# Altium schematic sheet XMOD.SchDoc
size A4; CompanyName: Technische Hochschule Nürnberg Georg Simon Ohm; Organization: UltraZohm; Address1: Kesslerplatz 12; Address2: 90489 Nürnberg; Address3: GERMANY; SheetNumber: 15; SheetTotal: 36; Website: www.ultrazohm.com
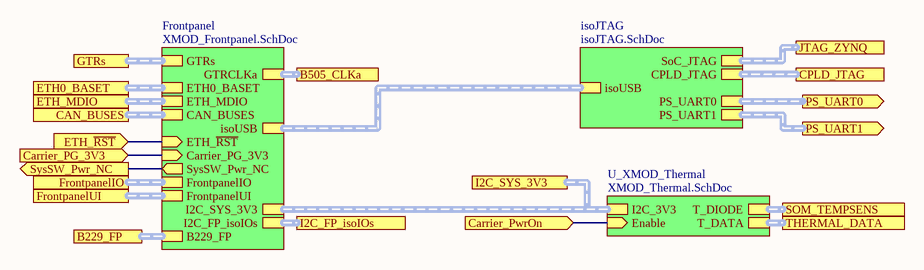
[diagram p0: XMOD.SchDoc]

## Sub-sheets
Frontpanel = XMOD_Frontpanel.SchDoc: GTRs (harness GTRs), ETH0_BASET (harness ETH_BASET), ETH_MDIO (harness ETH_MDIO), isoUSB (harness USB), I2C_SYS_3V3 (harness I2C), FrontpanelUI (harness FrontpanelUI), SysSW_Pwr_NC (out), GTRCLKa (harness MGTCLK), CAN_BUSES (harness CAN_BUSES), FrontpanelIO (harness FrontpanelIO), ETH_~{RST} (in), Carrier_PG_3V3 (in), I2C_FP_isoIOs (harness I2C), B229_FP (harness GTH)
isoJTAG = isoJTAG.SchDoc: SoC_JTAG (harness JTAG), CPLD_JTAG (harness JTAG), PS_UART0 (harness UART), PS_UART1 (harness UART), isoUSB (harness USB)
U_XMOD_Thermal = XMOD_Thermal.SchDoc: I2C_3V3 (harness I2C), T_DIODE (harness T_DIODE), T_DATA (harness T_DATA), Enable (in)

## Ports
B229_FP (harness GTH), B505_CLKa (harness MGTCLK), CAN_BUSES (harness CAN_BUSES), Carrier_PG_3V3 (in), Carrier_PwrOn (in), CPLD_JTAG (harness JTAG), ETH0_BASET (harness ETH_BASET), ETH_MDIO (harness ETH_MDIO), ETH_~{RST} (in), FrontpanelIO (harness FrontpanelIO), FrontpanelUI (harness FrontpanelUI), GTRs (harness GTRs), I2C_FP_isoIOs (harness I2C), I2C_SYS_3V3 (harness I2C), JTAG_ZYNQ (harness JTAG), PS_UART0 (out, harness UART), PS_UART1 (out, harness UART), SOM_TEMPSENS (harness T_DIODE), SysSW_Pwr_NC (out), THERMAL_DATA (harness T_DATA)

## Nets
Carrier_PG_3V3: port Carrier_PG_3V3, sheet Frontpanel/Carrier_PG_3V3
Carrier_PwrOn: port Carrier_PwrOn, sheet U_XMOD_Thermal/Enable
ETH_~{RST}: port ETH_~{RST}, sheet Frontpanel/ETH_~{RST}
SysSW_Pwr_NC: port SysSW_Pwr_NC, sheet Frontpanel/SysSW_Pwr_NC

## Buses and harness runs
harness port B229_FP = sheet Frontpanel/B229_FP
harness port B505_CLKa = sheet Frontpanel/GTRCLKa
harness port CAN_BUSES = sheet Frontpanel/CAN_BUSES
harness port CPLD_JTAG = sheet isoJTAG/CPLD_JTAG
harness port ETH0_BASET = sheet Frontpanel/ETH0_BASET
harness port ETH_MDIO = sheet Frontpanel/ETH_MDIO
harness port FrontpanelIO = sheet Frontpanel/FrontpanelIO
harness port FrontpanelUI = sheet Frontpanel/FrontpanelUI
harness port GTRs = sheet Frontpanel/GTRs
harness port I2C_FP_isoIOs = sheet Frontpanel/I2C_FP_isoIOs
harness port I2C_SYS_3V3 = sheet Frontpanel/I2C_SYS_3V3 = sheet U_XMOD_Thermal/I2C_3V3
harness port JTAG_ZYNQ = sheet isoJTAG/SoC_JTAG
harness port PS_UART0 = sheet isoJTAG/PS_UART0
harness port PS_UART1 = sheet isoJTAG/PS_UART1
harness port SOM_TEMPSENS = sheet U_XMOD_Thermal/T_DIODE
harness port THERMAL_DATA = sheet U_XMOD_Thermal/T_DATA
harness sheet Frontpanel/isoUSB = sheet isoJTAG/isoUSB

## Notes on the sheet
- Title
- Revision:
- Design Engineer:
- Date:
- Project:
- Sheet
- of